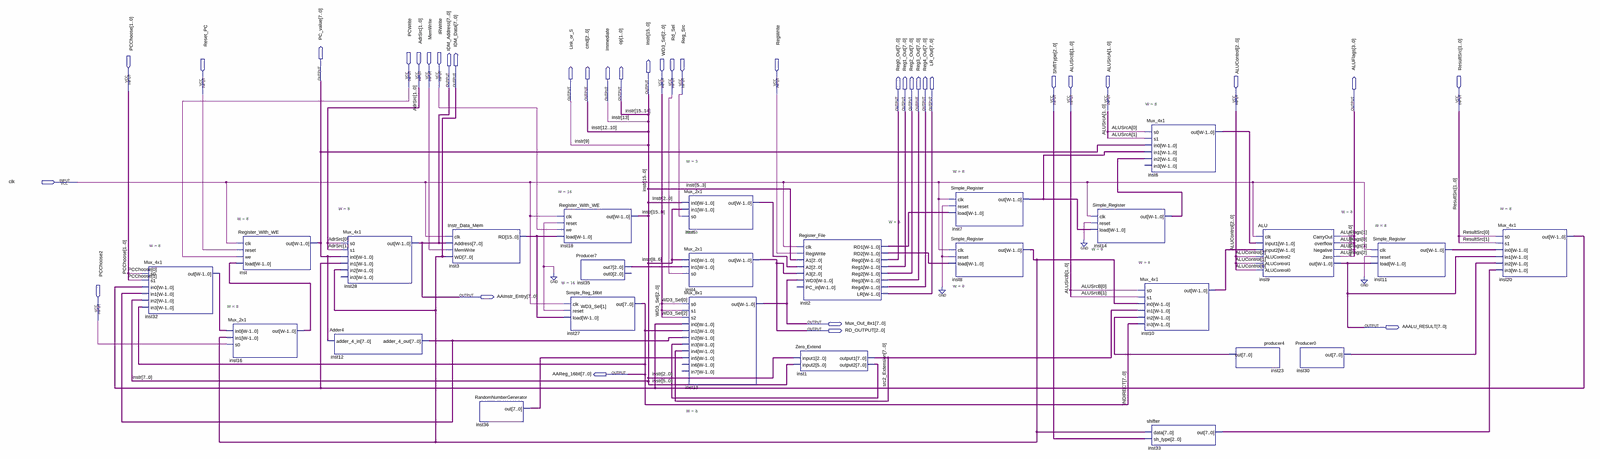
[diagram p0: schematic sheet, whole]
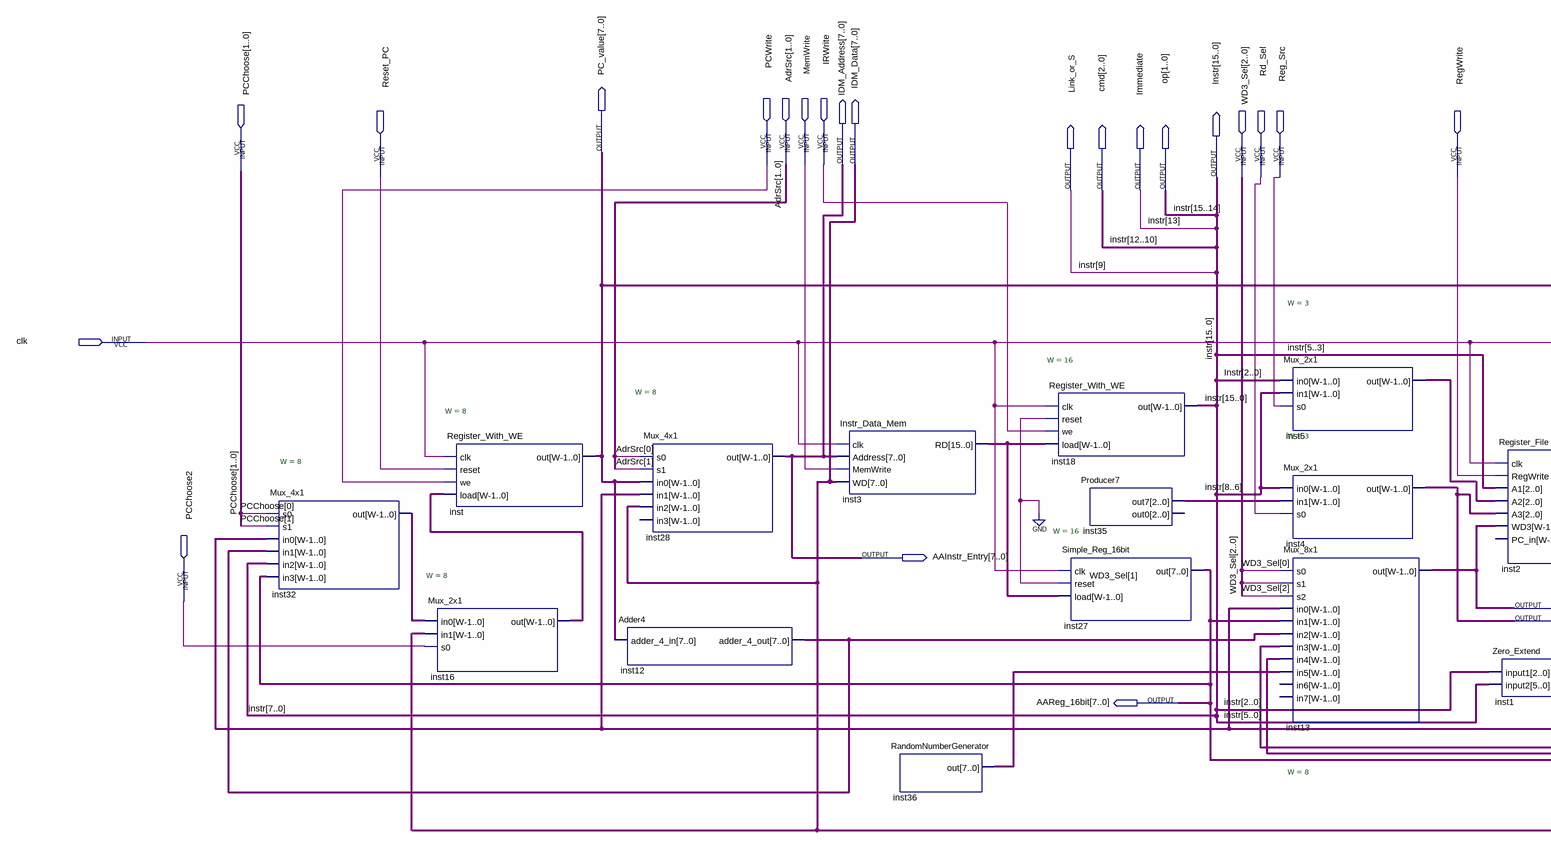
[diagram p1: schematic sheet, left part]
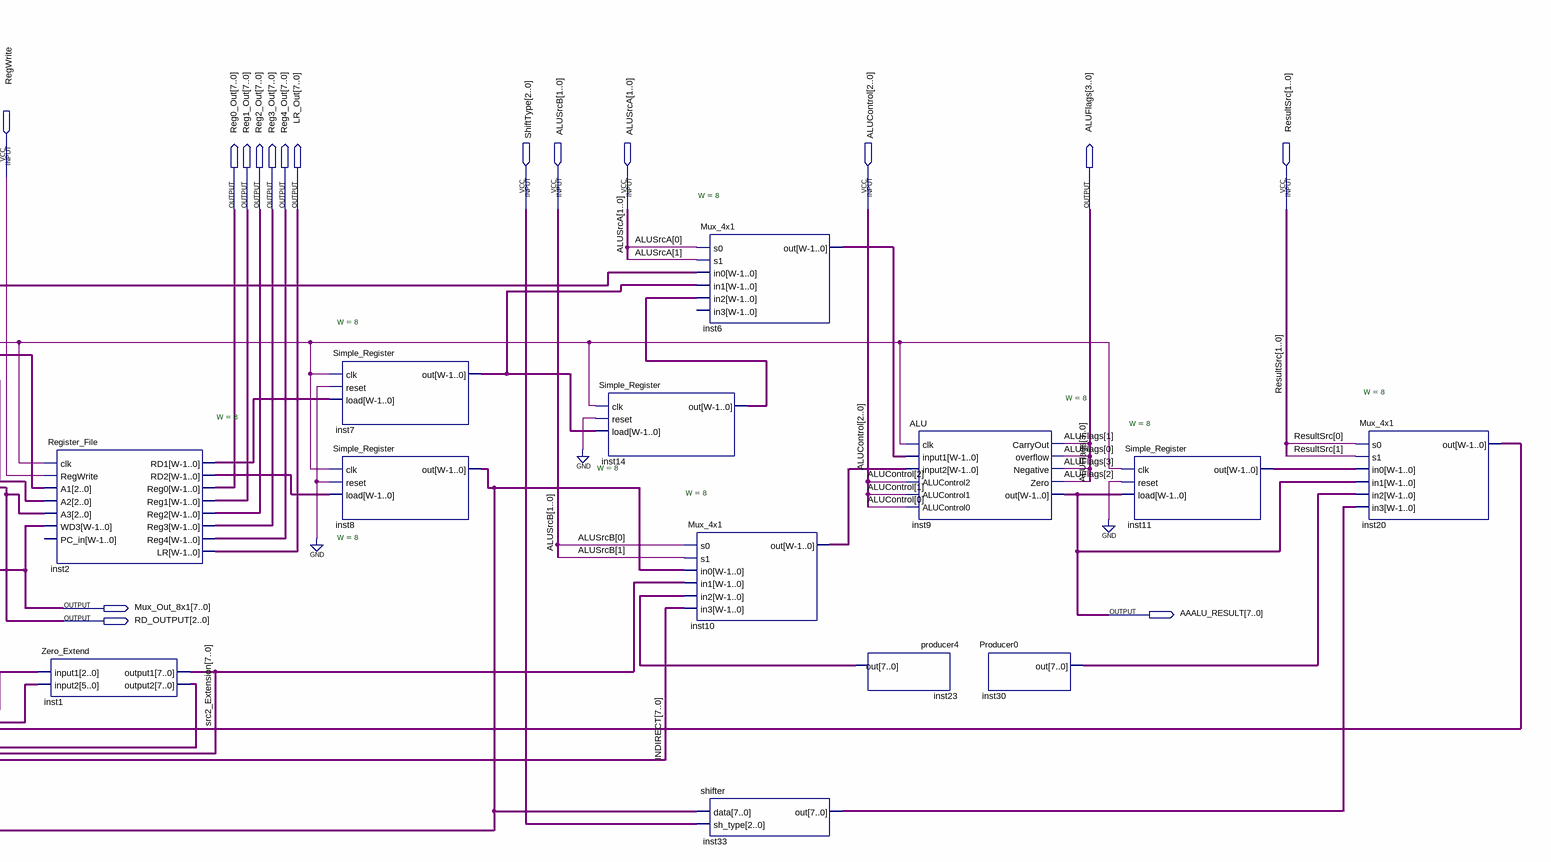
[diagram p2: schematic sheet, right part]
// Quartus schematic Main.bdf as structural Verilog: 26 symbols, 37 pins
module Main (
  input  PCWrite,
  input  [1:0] AdrSrc,
  input  MemWrite,
  input  IRWrite,
  input  [1:0] PCChoose,
  input  Reset_PC,
  input  [2:0] WD3_Sel,
  input  Rd_Sel,
  input  Reg_Src,
  input  RegWrite,
  input  [2:0] ShiftType,
  input  [1:0] ALUSrcB,
  input  [1:0] ALUSrcA,
  input  [2:0] ALUControl,
  input  [1:0] ResultSrc,
  input  clk,
  input  PCChoose2,
  output [7:0] PC_value,
  output [7:0] IDM_Address,
  output [7:0] IDM_Data,
  output [15:0] Instr,
  output Link_or_S,
  output [2:0] cmd,
  output Immediate,
  output [1:0] op,
  output [7:0] Reg0_Out,
  output [7:0] Reg1_Out,
  output [7:0] Reg2_Out,
  output [7:0] Reg3_Out,
  output [7:0] Reg4_Out,
  output [7:0] LR_Out,
  output [3:0] ALUFlags,
  output [7:0] AAInstr_Entry,
  output [7:0] Mux_Out_8x1,
  output [7:0] AAALU_RESULT,
  output [2:0] RD_OUTPUT,
  output [7:0] AAReg_16bit
);

  wire [2:0] inst5_out, inst35_out7;
  wire [7:0] inst1_output2, inst2_rd1, inst2_rd2, inst6_out, inst7_out, inst10_out, inst11_out,
       inst12_adder_4_out, inst14_out, inst16_out, inst20_out, inst23_out, inst30_out, inst32_out,
       inst33_out, inst36_out, src2_Extension;
  wire [15:0] inst3_rd;

  Mux_4x1 #(.W(8)) inst32 (
    .s0(PCChoose[0]), .s1(PCChoose[1]), .in0(inst20_out), .in1(inst12_adder_4_out), .in2(Instr[7:0]),
    .in3(AAReg_16bit), .out(inst32_out));
  Register_With_WE #(.W(8)) inst (.clk(clk), .reset(Reset_PC), .we(PCWrite), .load(inst16_out), .out(PC_value));
  Mux_2x1 #(.W(8)) inst16 (.in0(inst32_out), .in1(IDM_Data), .s0(PCChoose2), .out(inst16_out));
  Mux_4x1 #(.W(8)) inst28 (
    .s0(AdrSrc[0]), .s1(AdrSrc[1]), .in0(PC_value), .in1(inst20_out), .in2(IDM_Data), .out(AAInstr_Entry));  // open: in3
  Adder4 inst12 (.adder_4_in(PC_value), .adder_4_out(inst12_adder_4_out));
  Instr_Data_Mem inst3 (.clk(clk), .Address(AAInstr_Entry), .MemWrite(MemWrite), .WD(IDM_Data), .RD(inst3_rd));
  RandomNumberGenerator inst36 (.out(inst36_out));
  Register_With_WE #(.W(16)) inst18 (
    .clk(clk), .reset(1'b0), .we(IRWrite), .load(inst3_rd), .out({Instr[15:14], Immediate, cmd, Instr[9:0]}));
  Simple_Reg_16bit #(.W(16)) inst27 (.clk(clk), .reset(1'b0), .load(inst3_rd), .out(AAReg_16bit));
  Producer7 inst35 (.out7(inst35_out7));  // open: out0
  Mux_2x1 #(.W(3)) inst5 (.in0(Instr[2:0]), .in1(Instr[8:6]), .s0(Reg_Src), .out(inst5_out));
  Mux_2x1 #(.W(3)) inst4 (.in0(Instr[8:6]), .in1(inst35_out7), .s0(Rd_Sel), .out(RD_OUTPUT));
  Mux_8x1 #(.W(8)) inst13 (
    .s0(WD3_Sel[0]), .s1(WD3_Sel[1]), .s2(WD3_Sel[2]), .in0(inst20_out), .in1(AAReg_16bit),
    .in2(inst12_adder_4_out), .in3(inst1_output2), .in4(src2_Extension), .in5(inst36_out), .out(Mux_Out_8x1));  // open: in6, in7
  Register_File #(.W(8)) inst2 (
    .clk(clk), .RegWrite(RegWrite), .A1(Instr[5:3]), .A2(inst5_out), .A3(RD_OUTPUT), .WD3(Mux_Out_8x1),
    .RD1(inst2_rd1), .RD2(inst2_rd2), .Reg0(Reg0_Out), .Reg1(Reg1_Out), .Reg2(Reg2_Out), .Reg3(Reg3_Out),
    .Reg4(Reg4_Out), .LR(LR_Out));  // open: PC_in
  Zero_Extend inst1 (.input1(Instr[2:0]), .input2(Instr[5:0]), .output1(src2_Extension), .output2(inst1_output2));
  Simple_Register #(.W(8)) inst7 (.clk(clk), .reset(1'b0), .load(inst2_rd1), .out(inst7_out));
  Simple_Register #(.W(8)) inst8 (.clk(clk), .reset(1'b0), .load(inst2_rd2), .out(IDM_Data));
  Simple_Register #(.W(8)) inst14 (.clk(clk), .reset(1'b0), .load(inst7_out), .out(inst14_out));
  Mux_4x1 #(.W(8)) inst6 (
    .s0(ALUSrcA[0]), .s1(ALUSrcA[1]), .in0(PC_value), .in1(inst7_out), .in2(inst14_out), .out(inst6_out));  // open: in3
  Mux_4x1 #(.W(8)) inst10 (
    .s0(ALUSrcB[0]), .s1(ALUSrcB[1]), .in0(IDM_Data), .in1(src2_Extension), .in2(inst23_out),
    .in3(AAReg_16bit), .out(inst10_out));
  shifter inst33 (.data(IDM_Data), .sh_type(ShiftType), .out(inst33_out));
  producer4 inst23 (.out(inst23_out));
  ALU #(.W(8)) inst9 (
    .clk(clk), .input1(inst6_out), .input2(inst10_out), .ALUControl2(ALUControl[2]),
    .ALUControl1(ALUControl[1]), .ALUControl0(ALUControl[0]), .CarryOut(ALUFlags[1]), .overflow(ALUFlags[0]),
    .Negative(ALUFlags[3]), .Zero(ALUFlags[2]), .out(AAALU_RESULT));
  Producer0 inst30 (.out(inst30_out));
  Simple_Register #(.W(8)) inst11 (.clk(clk), .reset(1'b0), .load(AAALU_RESULT), .out(inst11_out));
  Mux_4x1 #(.W(8)) inst20 (
    .s0(ResultSrc[0]), .s1(ResultSrc[1]), .in0(inst11_out), .in1(AAALU_RESULT), .in2(inst30_out),
    .in3(inst33_out), .out(inst20_out));

  assign IDM_Address = AAInstr_Entry;
  assign Instr[13:10] = {Immediate, cmd};
  assign Link_or_S = Instr[9];
  assign op = Instr[15:14];

  // Other names for the same wires on the sheet: INDIRECT[7:0] = AAReg_16bit
endmodule
